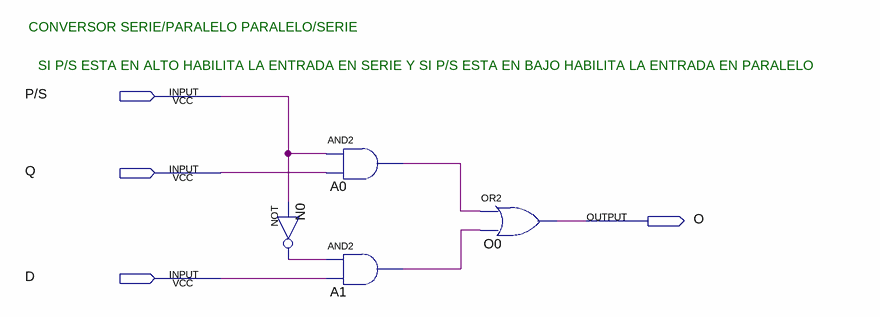
[diagram p0: schematic sheet]
// Quartus schematic Conversorspps.bdf as structural Verilog: 4 symbols, 4 pins
module Conversorspps (
  input  \P/S ,
  input  Q,
  input  D,
  output O
);

  wire A0_out, A1_out, N0_out;

  not N0 (N0_out, \P/S );
  and A0 (A0_out, \P/S , Q);
  and A1 (A1_out, N0_out, D);
  or O0 (O, A0_out, A1_out);

  // Notes on the sheet:
  //   CONVERSOR SERIE/PARALELO PARALELO/SERIE
  //   SI P/S ESTA EN ALTO HABILITA LA ENTRADA EN SERIE Y SI P/S ESTA EN BAJO HABILITA LA ENTRADA EN PARALELO
endmodule
